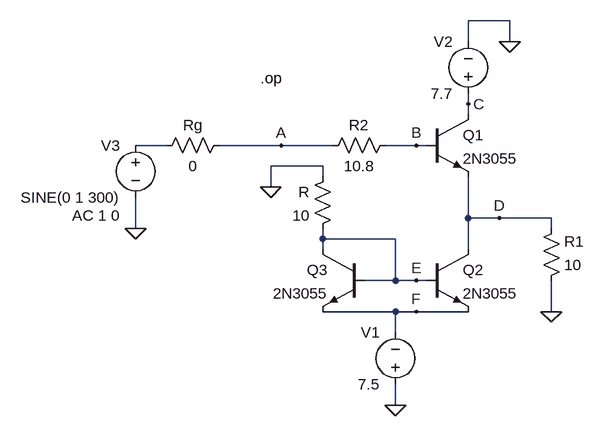
[diagram p0: schematic Lab2.asc]
Lab2.asc, the LTspice schematic file:
Version 4
SHEET 1 880 680
WIRE 288 -64 224 -64
WIRE 224 -32 224 -64
WIRE 288 -32 288 -64
WIRE 224 64 224 48
WIRE 224 80 224 64
WIRE -240 128 -288 128
WIRE -64 128 -160 128
WIRE 16 128 -64 128
WIRE 144 128 96 128
WIRE 160 128 144 128
WIRE 0 160 -80 160
WIRE 0 176 0 160
WIRE -80 192 -80 160
WIRE 224 240 224 176
WIRE 272 240 224 240
WIRE 352 240 272 240
WIRE -288 256 -288 208
WIRE 352 256 352 240
WIRE 0 272 0 256
WIRE 112 272 0 272
WIRE 0 288 0 272
WIRE 224 288 224 240
WIRE 112 336 112 272
WIRE 112 336 64 336
WIRE 144 336 112 336
WIRE 160 336 144 336
WIRE 112 384 0 384
WIRE 144 384 112 384
WIRE 224 384 144 384
WIRE 352 384 352 336
WIRE 112 416 112 384
WIRE 112 528 112 496
FLAG -80 192 0
FLAG 112 528 0
FLAG 352 384 0
FLAG 288 -32 0
FLAG -288 256 0
FLAG -64 128 A
FLAG 144 128 B
FLAG 224 64 C
FLAG 272 240 D
FLAG 144 336 E
FLAG 144 384 F
SYMBOL res 16 160 M0
SYMATTR InstName R
SYMATTR Value 10
SYMBOL npn 160 80 R0
SYMATTR InstName Q1
SYMATTR Value 2N3055
SYMBOL npn 160 288 R0
SYMATTR InstName Q2
SYMATTR Value 2N3055
SYMBOL npn 64 288 M0
SYMATTR InstName Q3
SYMATTR Value 2N3055
SYMBOL voltage 112 512 R180
WINDOW 0 24 96 Left 2
WINDOW 3 24 16 Left 2
WINDOW 123 0 0 Left 0
WINDOW 39 0 0 Left 0
SYMATTR InstName V1
SYMATTR Value 7.5
SYMBOL res 336 352 M180
WINDOW 0 36 76 Left 2
WINDOW 3 36 40 Left 2
SYMATTR InstName R1
SYMATTR Value 10
SYMBOL voltage 224 64 R180
WINDOW 0 24 96 Left 2
WINDOW 3 24 16 Left 2
WINDOW 123 0 0 Left 0
WINDOW 39 0 0 Left 0
SYMATTR InstName V2
SYMATTR Value 7.7
SYMBOL voltage -288 112 M0
WINDOW 123 24 124 Left 2
WINDOW 39 0 0 Left 0
SYMATTR Value2 AC 1 0
SYMATTR InstName V3
SYMATTR Value SINE(0 1 300)
SYMBOL res -144 112 R90
WINDOW 0 0 56 VBottom 2
WINDOW 3 32 56 VTop 2
SYMATTR InstName Rg
SYMATTR Value 0
SYMBOL res 112 112 R90
WINDOW 0 0 56 VBottom 2
WINDOW 3 32 56 VTop 2
SYMATTR InstName R2
SYMATTR Value 10.8
TEXT -96 24 Left 2 !.op

The netlist it stands for:
* Lab2.asc
R 0 E 10
Q1 C B D 0 2N3055
Q2 D E F 0 2N3055
Q3 E E F 0 2N3055
V1 0 F 7.5
R1 0 D 10
V2 C 0 7.7
V3 N001 0 SINE(0 1 300) AC 1 0
Rg A N001 0
R2 B A 10.8
.model NPN NPN
.model PNP PNP
.lib standard.bjt
.op
.backanno
.end